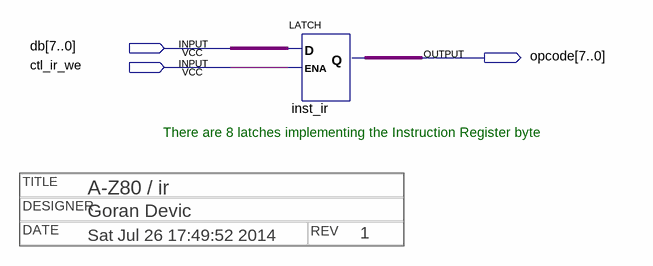
[diagram p0: schematic sheet]
// Quartus schematic ir.bdf as structural Verilog: 1 symbols, 3 pins
// Title block: DATE: Sat Jul 26 17:49:52 2014; DESIGNER: Goran Devic; REV: 1; TITLE: A-Z80 / ir
module ir (
  input  [7:0] db,
  input  ctl_ir_we,
  output [7:0] opcode
);

  LATCH inst_ir[7:0] (.D(db), .ENA(ctl_ir_we), .Q(opcode));

  // Notes on the sheet:
  //   There are 8 latches implementing the Instruction Register byte
endmodule
